# EAGLE design cableVGA (EAGLE 7.3.0)
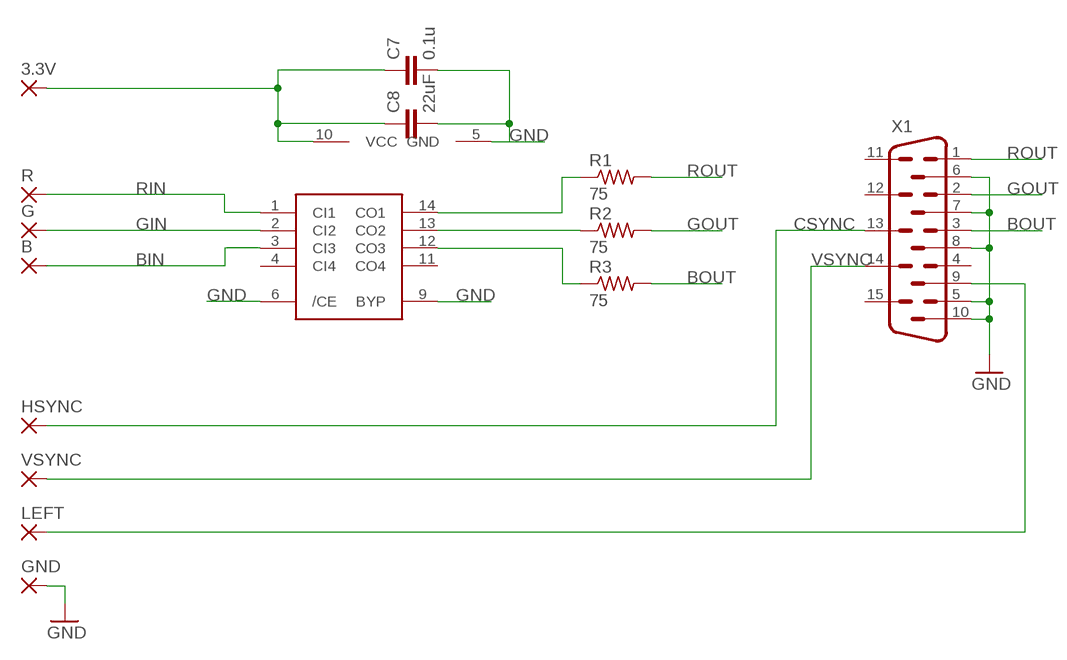
[diagram p0: schematic, sheet 1]

## Parts
3.3V  WIREPADSMD2,54-5,08  [SMD2,54-5,08]
B  WIREPADSMD2,54-5,08  [SMD2,54-5,08]
C7  0.1u  C-EUC0805K  [C0805K]
C8  22uF  C-EUC0805K  [C0805K]
G  WIREPADSMD2,54-5,08  [SMD2,54-5,08]
GND  WIREPADSMD2,54-5,08  [SMD2,54-5,08]
HSYNC  WIREPADSMD2,54-5,08  [SMD2,54-5,08]
LEFT  WIREPADSMD2,54-5,08  [SMD2,54-5,08]
R  WIREPADSMD2,54-5,08  [SMD2,54-5,08]
R1  75  R-US_R0805  [R0805]
R2  75  R-US_R0805  [R0805]
R3  75  R-US_R0805  [R0805]
U$2  THS7374  [THS7374]
VSYNC  WIREPADSMD2,54-5,08  [SMD2,54-5,08]
X1  HM15H  [HDM15H]

## Nets
3.3V: 3.3V.1(P) C7.1 C8.1 U$2.10(VCC)
BIN: B.1(P) U$2.3(CI3)
BOUT: R3.2 X1.3
CSYNC: HSYNC.1(P) X1.13
GIN: G.1(P) U$2.2(CI2)
GND: C7.2 C8.2 GND.1(P) U$2.5(GND) U$2.6(/CE) U$2.9(BYP) X1.5 X1.6 X1.7 X1.8 X1.10
GOUT: R2.2 X1.2
LEFT: LEFT.1(P) X1.9
N$1: R2.1 U$2.13(CO2)
N$2: R1.1 U$2.14(CO1)
N$3: R3.1 U$2.12(CO3)
RIN: R.1(P) U$2.1(CI1)
ROUT: R1.2 X1.1
VSYNC: VSYNC.1(P) X1.14
Unconnected: U$2.4(CI4) U$2.11(CO4) X1.4 X1.11 X1.12 X1.15

## Library data of the parts
3.3V B G GND HSYNC LEFT R VSYNC = wirepad:WIREPAD: Wire PAD connect wire on PCB
C7 C8 = rcl:C-EU: CAPACITOR, European symbol
R1-R3 = rcl:R-US_: RESISTOR, American symbol
U$2 = snes_div:THS7374
X1 = con-subd:HM15: SUB-D; OC_FARNELL: unknown; OC_NEWARK: unknown

## Board
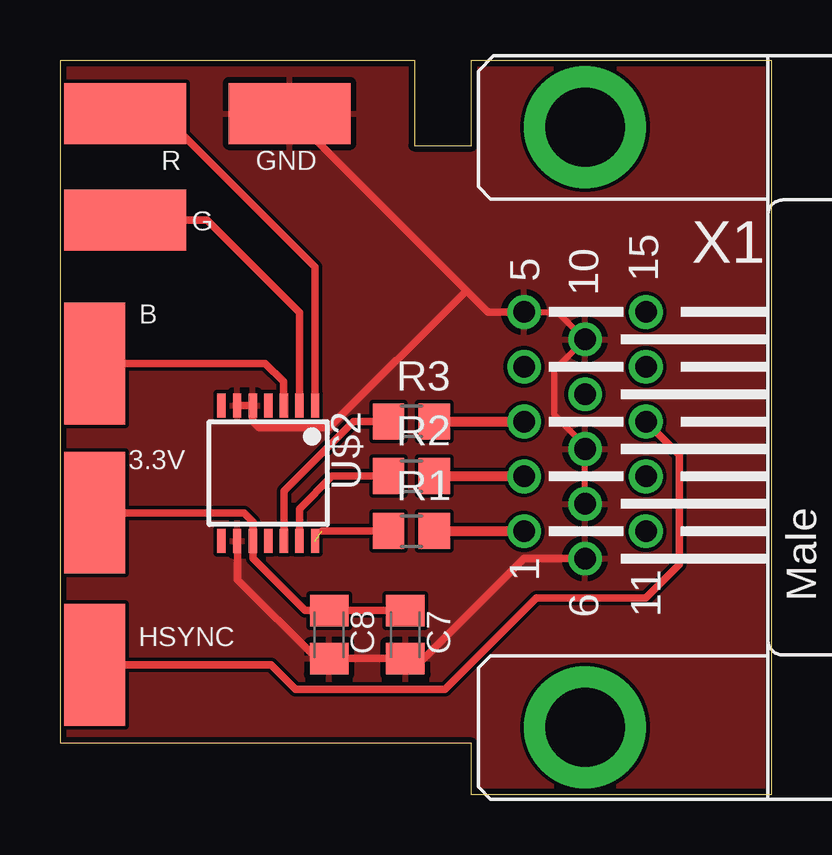
[diagram p1: board, top side]
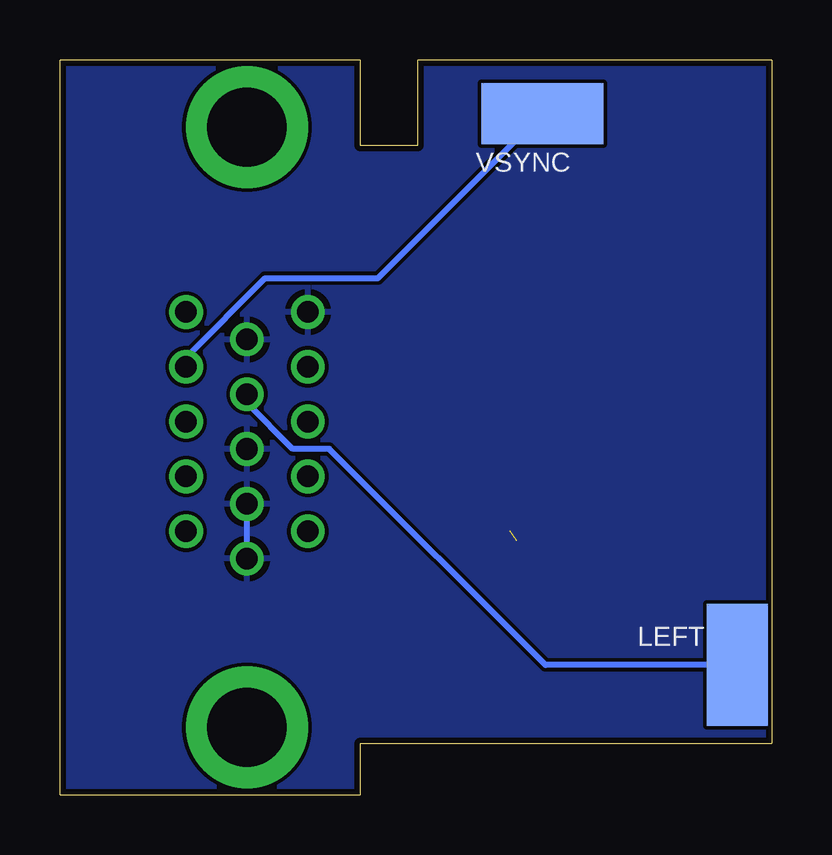
[diagram p2: board, bottom side, seen from below]

Size 29.69 x 30.64 mm. Coordinates in mm from the lower left corner, seen from the top.
Outline: 0,30.64 0,2.14 17.16,2.14 17.16,0 29.69,0 29.69,30.64 17.16,30.64 17.16,27.07 14.78,27.07 14.78,30.64 0,30.64
Copper layers (1*16): Top 0.035mm / dielectric 1.5mm / Bottom 0.035mm
Design rules "seedstudio_Fusion_eagle_rule_v1.1": minimum track width 6mil, minimum drill 12mil, track to track 6mil, track to pad 6mil, pad to pad 6mil, via to via 6mil, smd to smd 0mil, copper to edge 10mil, drill to drill 10mil, minimum pad ring 10mil, minimum via ring 6mil, stop-mask expansion 2mil, vias tented up to drill 100mil, thermal gap 10mil

### Footprints (pad centres in the part's own frame; a part is rotated, then mirrored left to right if it is on the bottom)
SMD2,54-5,08 = smd 2.54 x 5.08: 1 0,0
C0805K = smd 1.3 x 1.6: 1 -1,0; 2 1,0
R0805 = smd 1.3 x 1.5: 1 -0.95,0; 2 0.95,0
THS7374 = smd 0.35 x 1: 1 -1.95,-2.825; 2 -1.3,-2.825; 3 -0.65,-2.825; 4 0,-2.825; 5 0.65,-2.825; 6 1.3,-2.825; 7 1.95,-2.825; 8 1.95,2.825; 9 1.3,2.825; 10 0.65,2.825; 11 0,2.825; 12 -0.65,2.825; 13 -1.3,2.825; 14 -1.95,2.825
HDM15H = drill 0.9: 1 -4.329,2.54; 2 -2.043,2.54; 3 0.243,2.54; 4 2.529,2.54; 5 4.815,2.54; 6 -5.472,0; 7 -3.186,0; 8 -0.9,0; 9 1.386,0; 10 3.672,0; 11 -4.329,-2.54; 12 -2.043,-2.54; 13 0.243,-2.54; 14 2.529,-2.54; 15 4.815,-2.54 | drill 3.302 pad 5.08: G1 -12.5,0; G2 12.519,0

### Placement (x,y rotation side)
3.3V  1.44,11.76 0 top
B  1.44,17.99 180 top
C7  14.4,6.68 270 top
C8  11.22,6.68 270 top
G  2.71,23.96 90 top
GND  9.57,28.4 90 top
HSYNC  1.44,5.41 0 top
LEFT  1.44,5.41 180 bottom
R  2.71,28.4 90 top
R1  14.65,11 0 top
R2  14.65,13.29 0 top
R3  14.65,15.57 0 top
U$2  8.68,13.41 180 top
VSYNC  9.57,28.4 270 bottom
X1  21.89,15.32 90 top

### Tracks (layer width: path | path; a pad name or v marks a point on that pad's centre or on a via)
3.3V
  Top 0.305: 3.3V.1 7.67,11.76 8.05,11.38 8.05,10.6 U$2.10 8.05,10.57 8.05,9.86 10.22,7.68 C8.1 C7.1
BIN
  Top 0.305: B.1 8.56,17.99 9.32,17.22 9.32,16.25 U$2.3
BOUT
  Top 0.406: R3.2 19.35,15.57 X1.3
CSYNC
  Top 0.305: HSYNC.1 8.81,5.41 9.83,4.4 16.05,4.4 19.86,8.21 24.43,8.21 25.83,9.6 25.83,14.17 X1.13
GIN
  Top 0.305: G.1 6.14,23.96 9.98,20.12 U$2.2
GND
  Top 0.254: X1.5 20.75,20.13 X1.10 20.62,17.72 20.62,15.83 21.89,14.56 X1.8 X1.7
  Top 0.305: U$2.9 7.41,10.56 7.41,8.97 10.7,5.68 C8.2 C7.2 14.41,5.67 15.16,5.67 19.34,9.85 X1.6 | X1.5 17.84,20.13 16.94,21.03 | 16.94,21.03 GND.1 | 16.94,21.03 11.22,15.32 8.3,15.32 8.03,15.59 U$2.5 U$2.6
  Bottom 0.254: X1.6 X1.7
  pour Bottom: 0.17,30.56 29.64,30.56 29.64,0.08 0.17,0.08 0.17,30.43
  pour Top: 0.17,30.56 29.64,30.56 29.64,0.08 0.17,0.08 0.17,30.43
GOUT
  Top 0.406: R2.2 X1.2
LEFT
  Bottom 0.254: X1.9 21.89,16.34 19.99,14.43 18.46,14.43 9.45,5.41 LEFT.1
N$1
  Top 0.305: R2.1 11.35,13.29 9.98,11.92 U$2.13
N$2  (1 unrouted)
  Top 0.305: R1.1 10.92,11
N$3
  Top 0.305: R3.1 12.24,15.57 9.33,12.67 U$2.12
RIN
  Top 0.305: R.1 4.24,28.4 10.63,22.01 U$2.1
ROUT
  Top 0.406: R1.2 19.35,11 X1.1
VSYNC
  Bottom 0.254: X1.14 24.43,18.24 21.13,21.54 16.43,21.54 VSYNC.1 9.19,28.4